# Altium project Motor_Driver.PrjPCB
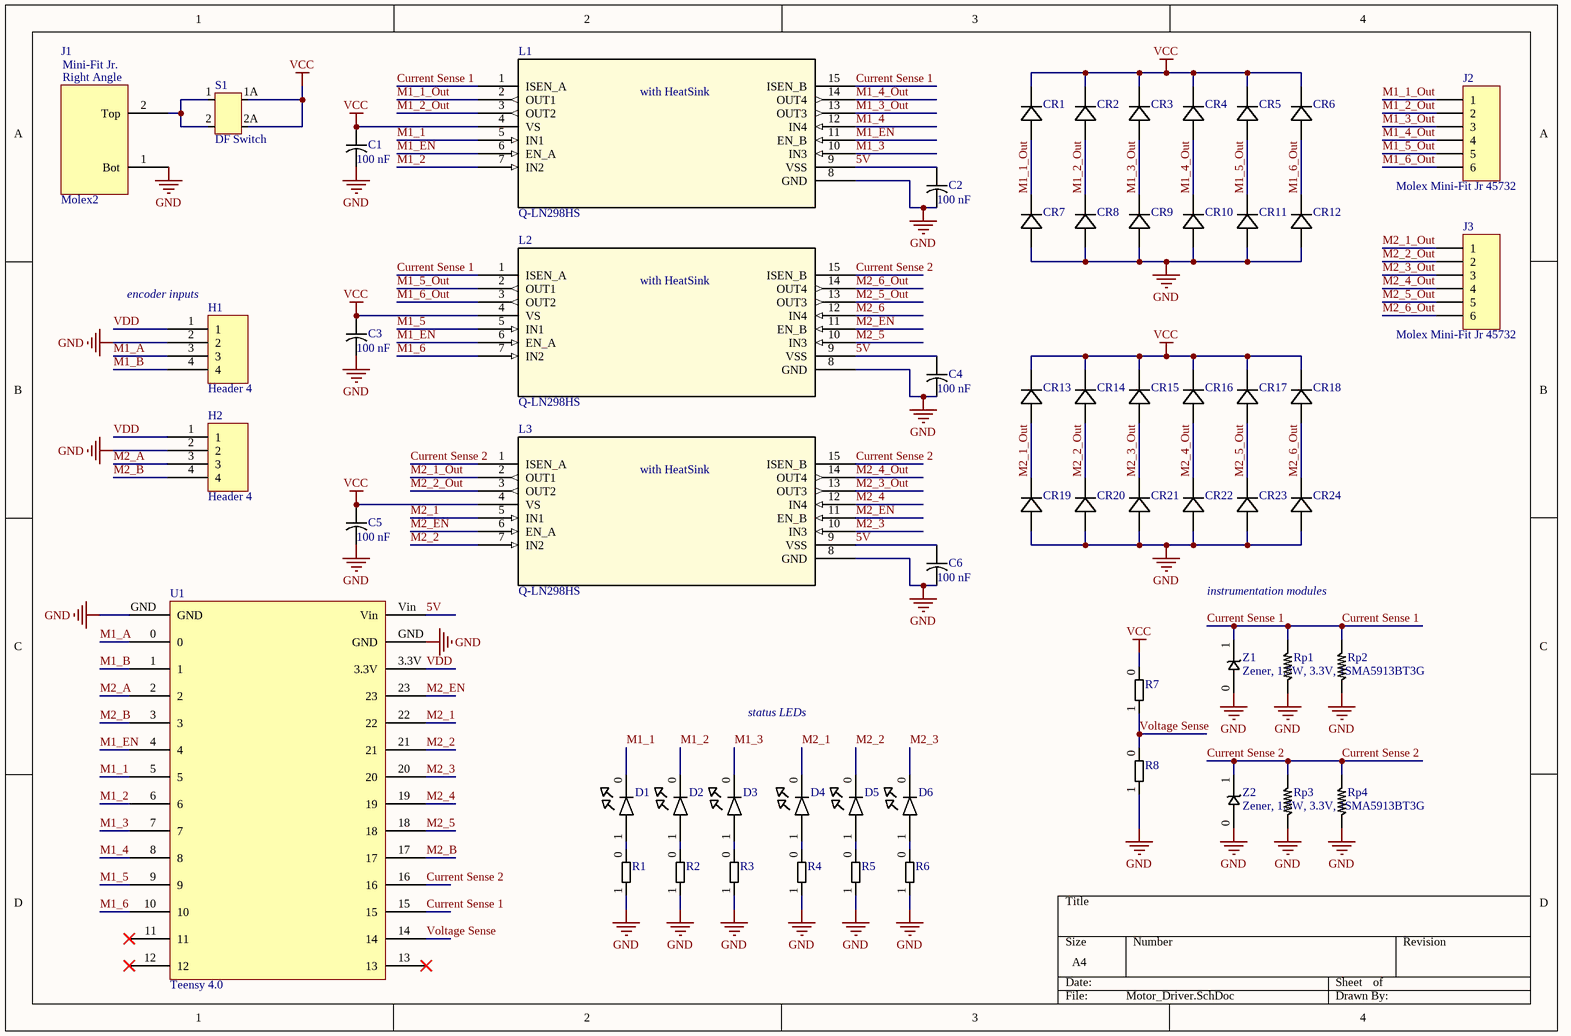
[diagram p0: Motor_Driver.SchDoc]
1 sheet, 60 parts. Net scope: global (net labels, ports and power ports of the same name join across sheets).
Board file: Motor_Driver.PcbDoc

## Sheet Motor_Driver.SchDoc
size A4

### Parts
C1  100 nF  [CC0805N-M]
C2  100 nF  [CC0805N-M]
C3  100 nF  [CC0805N-M]
C4  100 nF  [CC0805N-M]
C5  100 nF  [CC0805N-M]
C6  100 nF  [CC0805N-M]
CR1  Part Number: SD1206S040S2R0  [SD1206]  (value not drawn)
CR2  Part Number: SD1206S040S2R0  [SD1206]  (value not drawn)
CR3  Part Number: SD1206S040S2R0  [SD1206]  (value not drawn)
CR4  Part Number: SD1206S040S2R0  [SD1206]  (value not drawn)
CR5  Part Number: SD1206S040S2R0  [SD1206]  (value not drawn)
CR6  Part Number: SD1206S040S2R0  [SD1206]  (value not drawn)
CR7  Part Number: SD1206S040S2R0  [SD1206]  (value not drawn)
CR8  Part Number: SD1206S040S2R0  [SD1206]  (value not drawn)
CR9  Part Number: SD1206S040S2R0  [SD1206]  (value not drawn)
CR10  Part Number: SD1206S040S2R0  [SD1206]  (value not drawn)
CR11  Part Number: SD1206S040S2R0  [SD1206]  (value not drawn)
CR12  Part Number: SD1206S040S2R0  [SD1206]  (value not drawn)
CR13  Part Number: SD1206S040S2R0  [SD1206]  (value not drawn)
CR14  Part Number: SD1206S040S2R0  [SD1206]  (value not drawn)
CR15  Part Number: SD1206S040S2R0  [SD1206]  (value not drawn)
CR16  Part Number: SD1206S040S2R0  [SD1206]  (value not drawn)
CR17  Part Number: SD1206S040S2R0  [SD1206]  (value not drawn)
CR18  Part Number: SD1206S040S2R0  [SD1206]  (value not drawn)
CR19  Part Number: SD1206S040S2R0  [SD1206]  (value not drawn)
CR20  Part Number: SD1206S040S2R0  [SD1206]  (value not drawn)
CR21  Part Number: SD1206S040S2R0  [SD1206]  (value not drawn)
CR22  Part Number: SD1206S040S2R0  [SD1206]  (value not drawn)
CR23  Part Number: SD1206S040S2R0  [SD1206]  (value not drawn)
CR24  Part Number: SD1206S040S2R0  [SD1206]  (value not drawn)
D1  Test LED  [Test LED]  (value not drawn)
D2  Test LED  [Test LED]  (value not drawn)
D3  Test LED  [Test LED]  (value not drawn)
D4  Test LED  [Test LED]  (value not drawn)
D5  Test LED  [Test LED]  (value not drawn)
D6  Test LED  [Test LED]  (value not drawn)
H1  Header 4  [4 Header]
H2  Header 4  [4 Header]
J1  Molex2  [MOLEX MINI2]
J2  Molex Mini-Fit Jr 45732  [Molex Mini-Fit Jr]
J3  Molex Mini-Fit Jr 45732  [Molex Mini-Fit Jr]
L1  Q-LN298HS  [Multiwatt15_V_ELEC391HS]
L2  Q-LN298HS  [Multiwatt15_V_ELEC391HS]
L3  Q-LN298HS  [Multiwatt15_V_ELEC391HS]
R1  StdRes  [StdRes]  (value not drawn)
R2  StdRes  [StdRes]  (value not drawn)
R3  StdRes  [StdRes]  (value not drawn)
R4  StdRes  [StdRes]  (value not drawn)
R5  StdRes  [StdRes]  (value not drawn)
R6  StdRes  [StdRes]  (value not drawn)
R7  StdRes  [StdRes]  (value not drawn)
R8  StdRes  [StdRes]  (value not drawn)
Rp1  SQP500 Power Resistor  [SQP500 Power Resistor]  (value not drawn)
Rp2  SQP500 Power Resistor  [SQP500 Power Resistor]  (value not drawn)
Rp3  SQP500 Power Resistor  [SQP500 Power Resistor]  (value not drawn)
Rp4  SQP500 Power Resistor  [SQP500 Power Resistor]  (value not drawn)
S1  DF Switch  [DF Switch]
U1  Teensy 4.0  [Teensy 4.0]
Z1  Zener, 1.5W, 3.3V, 1SMA5913BT3G  [Zener, 1.5W, 3.3V, 1SMA5913BT3G]
Z2  Zener, 1.5W, 3.3V, 1SMA5913BT3G  [Zener, 1.5W, 3.3V, 1SMA5913BT3G]

### Nets
GND: C1.2 C2.2 C3.2 C4.2 C5.2 C6.2 CR7.2 CR8.2 CR9.2 CR10.2 CR11.2 CR12.2 CR19.2 CR20.2 CR21.2 CR22.2 CR23.2 CR24.2 H1.2 H2.2 J1.1(Bot) L1.8(GND) L2.8(GND) L3.8(GND) R1.1 R2.1 R3.1 R4.1 R5.1 R6.1 R8.1 Rp1.0 Rp2.0 Rp3.0 Rp4.0 U1.GND Z1.0 Z2.0
VCC: C1.1 C3.1 C5.1 CR1.1 CR2.1 CR3.1 CR4.1 CR5.1 CR6.1 CR13.1 CR14.1 CR15.1 CR16.1 CR17.1 CR18.1 L1.4(VS) L2.4(VS) L3.4(VS) R7.0 S1.1A S1.2A
5V: C2.1 C4.1 C6.1 L1.9(VSS) L2.9(VSS) L3.9(VSS) U1.Vin
Current Sense 1: L1.1(ISEN_A) L1.15(ISEN_B) L2.1(ISEN_A) Rp1.1 Rp2.1 U1.15 Z1.1
Current Sense 2: L2.15(ISEN_B) L3.1(ISEN_A) L3.15(ISEN_B) Rp3.1 Rp4.1 U1.16 Z2.1
M1_1: D1.0 L1.5(IN1) U1.5
M1_1_Out: CR1.2 CR7.1 J2.1 L1.2(OUT1)
M1_2: D2.0 L1.7(IN2) U1.6
M1_2_Out: CR2.2 CR8.1 J2.2 L1.3(OUT2)
M1_3: D3.0 L1.10(IN3) U1.7
M1_3_Out: CR3.2 CR9.1 J2.3 L1.13(OUT3)
M1_4: L1.12(IN4) U1.8
M1_4_Out: CR4.2 CR10.1 J2.4 L1.14(OUT4)
M1_5: L2.5(IN1) U1.9
M1_5_Out: CR5.2 CR11.1 J2.5 L2.2(OUT1)
M1_6: L2.7(IN2) U1.10
M1_6_Out: CR6.2 CR12.1 J2.6 L2.3(OUT2)
M1_A: H1.3 U1.0
M1_B: H1.4 U1.1
M1_EN: L1.6(EN_A) L1.11(EN_B) L2.6(EN_A) U1.4
M2_1: D4.0 L3.5(IN1) U1.22
M2_1_Out: CR13.2 CR19.1 J3.1 L3.2(OUT1)
M2_2: D5.0 L3.7(IN2) U1.21
M2_2_Out: CR14.2 CR20.1 J3.2 L3.3(OUT2)
M2_3: D6.0 L3.10(IN3) U1.20
M2_3_Out: CR15.2 CR21.1 J3.3 L3.13(OUT3)
M2_4: L3.12(IN4) U1.19
M2_4_Out: CR16.2 CR22.1 J3.4 L3.14(OUT4)
M2_5: L2.10(IN3) U1.18
M2_5_Out: CR17.2 CR23.1 J3.5 L2.13(OUT3)
M2_6: L2.12(IN4)
M2_6_Out: CR18.2 CR24.1 J3.6 L2.14(OUT4)
M2_A: H2.3 U1.2
M2_B: H2.4 U1.3 U1.17
M2_EN: L2.11(EN_B) L3.6(EN_A) L3.11(EN_B) U1.23
VDD: H1.1 H2.1 U1.3.3V
Voltage Sense: R7.1 R8.0 U1.14
NetD1_1: D1.1 R1.0
NetD2_1: D2.1 R2.0
NetD3_1: D3.1 R3.0
NetD4_1: D4.1 R4.0
NetD5_1: D5.1 R5.0
NetD6_1: D6.1 R6.0
NetJ1_2: J1.2(Top) S1.1 S1.2

Not connected (* = marked no-connect by the designer): U1 11* 12* 13*

### Notes on the sheet
- (near H1) encoder inputs
- instrumentation modules
- status LEDs
- (in symbol Molex2) Mini-Fit Jr.; Right Angle
- (in symbol Q-LN298HS) with HeatSink

### Library data of the parts
C1-C6 = C0805C104M5RACTU: No Description Available; Vendor: Kemet; Built_By: EMA_UL_Team; Type: DEV; Manufacturer_Part_Number: C0805C104M5RACTU; Copyright: Copyright (C) 2018 Accelerated Designs. All rights reserved; RefDes: RefDes; Value: Value
CR1-CR24 = SD1206S040S2R0: Vendor: AVX Corporation; Built_By: EMA_UL_Team; Type: DEV; Manufacturer_Part_Number: SD1206S040S2R0; Copyright: Copyright (C) 2018 Accelerated Designs. All rights reserved; RefDes: RefDes; Value: Value
J2 J3 = Molex 0457320001: Molex CONN HEADER R/A 6POS 4.2MM; Supplier 1: Digi-Key; Supplier Part Number 1: WM10850-ND
L1-L3 = Q-LN298HS: LN298 - IC Bridge Driver Par 15Multiwatt; Manufacturer_Part_Number: L298N; Vendor: ST Microelectronics; Input Type: Non-Inverting; Number of Outputs: 4; Current - Output / Channel: 2A; Current - Peak Output: 3A; Voltage - Supply: 4.5 V ~ 46 V; C: Copyright (C) 2015 Accelerated Designs. All rights reserved; Quantity_Available: 5651; DataSheet: http://www.st.com/internet/com/TECHNICAL_RESOURCES/TECHNICAL_LITERATURE/DATASHEET/CD00000240.pdf; Type: Type; On-State Resistance: -; Operating Temperature: -25Â°C ~ 130Â°C; Mounting Type: Through Hole; Package / Case: Multiwatt-15 (Vertical, Bent and Staggered Leads); Supplier Device Package: 15-Multiwatt; Packaging: Tube; Copyright: Copyright (C) 2015 Accelerated Designs. All rights reserved; RefDes: RefDes; Value: Value; ComponentLink1URL: http://www.st.com/content/ccc/resource/technical/document/datasheet/82/cc/3f/39/0a/29/4d/f0/CD00000240.pdf/files/CD00000240.pdf/jcr:content/translations/en.CD00000240.pdf; ComponentLink1Description: Datasheet (ELEC391)